# EasyEDA Pro project chislfashV1.0 普罗米修斯.epro, board ChisFlash-Onix-1.2
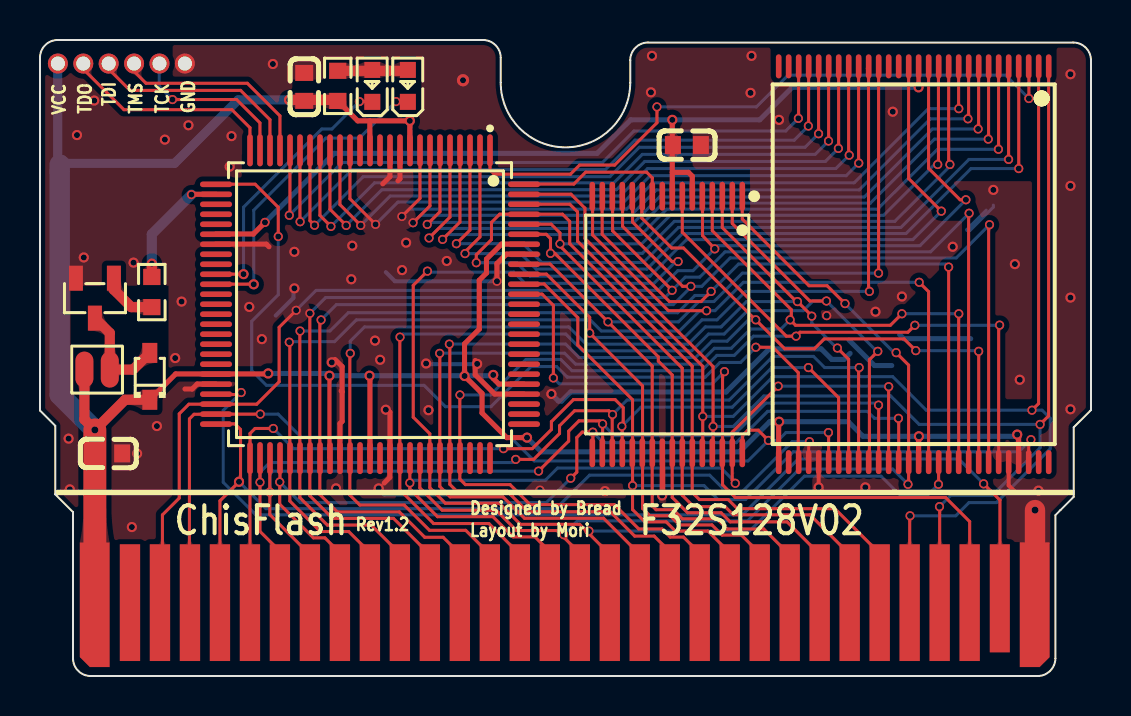
[diagram p4: board, top side]
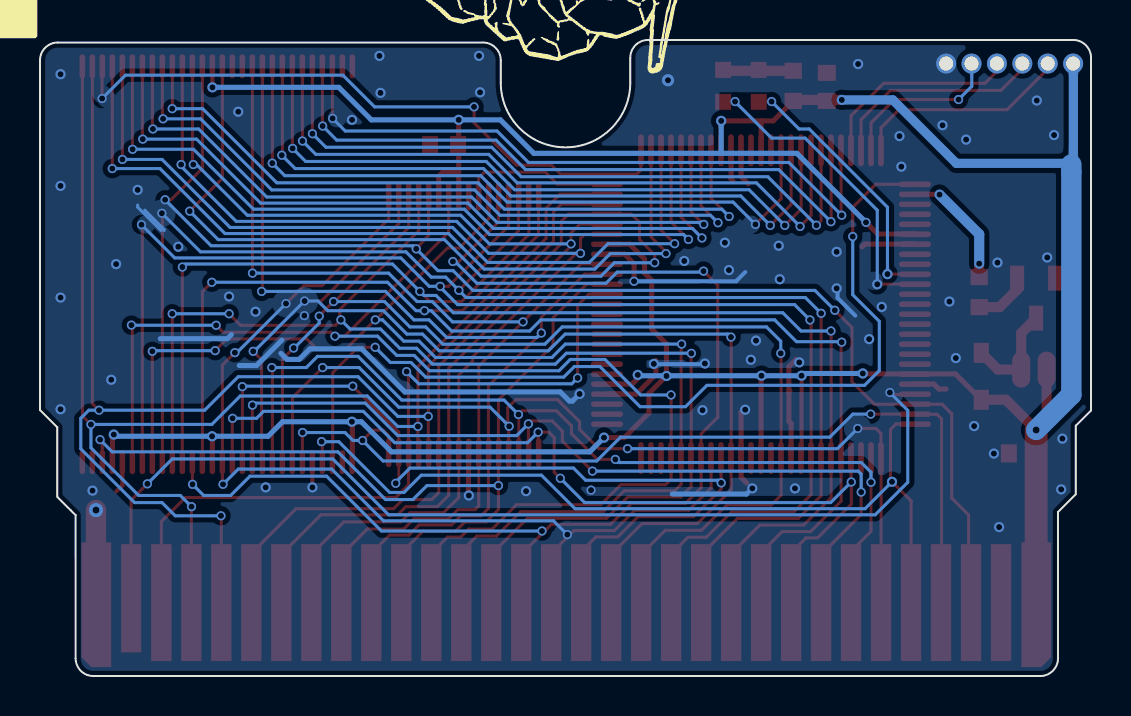
[diagram p5: board, bottom side, seen from below]

Outline 52.55 x 31.83 mm; copper layers: Top Layer, Bottom Layer. Coordinates in mm from the lower left corner of the outline.
Outline path: 0,30.94 0,13.28 0.76,12.52 0.76,9.09 1.65,8.2 1.65,0.89 arc(1.91,0.26) 2.54,0 49.88,0 arc(50.51,0.26) 50.77,0.89 50.77,8.05 51.69,8.97 51.69,12.45 52.55,13.31 52.55,30.81 arc(52.29,31.44) 51.66,31.7 30.4,31.7 arc(29.77,31.44) 29.51,30.81 29.51,29.69 arc(26.28,26.45) 23.04,29.69 23.04,30.94 arc(22.78,31.57) 22.15,31.83 0.89,31.83 arc(0.26,31.57) 0,30.94
Stack: Top Layer 0.035mm - / Dielectric1 1.51mm FR4 er 4.5 / Bottom Layer 0.035mm -

## Design rules (mm)
template: 自定义配置
spacing copperThickness1oz (default): track to track 0.152, other pairs 0.152 to 0.152
spacing copperThickness2oz: track to track 0.152, other pairs 0.152 to 0.152
track width copperThickness1oz (default): min 0.152, default 0.152, max 2.54
track width copperThickness2oz: min 0.152, default 0.254, max 2.54
differential pair differentialPair (default): width min 0.152, default 0.254, max 2.54; gap min 0.152, default 0.152
via viaSize (default): diameter min 0.406, default 0.457, max 10; hole min 0.305, default 0.305, max 6.299

## Placement (name value [footprint] x y rotation side)
C1  100nF  [C0603]  32.35 26.57 180 top
C2  100nF  [C0603]  13.21 29.48 270 top
C3  100nF  [C0603]  3.41 11.14 180 top
CART2  -  [GBA卡带金手指]  26.22 3.04 0 top
D1  1N4148WS  [SOD-323_L1.8-W1.3-LS2.5-RD]  5.49 15 90 top
LED1  NCD0603B1  [LED0603-RD]  16.62 29.53 90 top
LED2  NCD0603G1  [LED0603-RD]  18.4 29.53 90 top
MOT1  LCM1027A2445F  [VIBRATING-MOTOR-SMD_WELDING]  2.86 15.33 180 top
Q2  S9013 J3  [SOT-23-3_L2.9-W1.3-P1.90-LS2.4-BR]  2.75 18.91 90 top
R1  1kΩ  [R0603]  14.89 29.53 270 top
R3  10K  [R0603]  5.59 19.21 90 top
U2  S29GL256S10TFI010  [TSOP-56_L18.4-W14.0-P0.50-LS20.0-TL]  43.69 20.6 270 top
U4  FM28V100-TG  [STSOP-32_L8.0-W11.8-P0.50-LS13.4-TL]  31.37 17.59 270 top
U5  EPM240T100C5N  [TQFP-100_L14.0-W14.0-P0.50-LS16.0-BL]  16.5 18.6 180 top
XP1  JTAG  [HDR-TH_6P-P1.27-V-M-1]  4.07 30.65 0 top

## Footprints (pads in the part's own frame, mm; a bottom-side part is the same pattern mirrored in y, then rotated)
C0603
  rect 0.8x0.9 smd: 1(-0.7,0) 2(0.7,0)
GBA卡带金手指
  custom 1.491x6.239 smd: 1(-23.48,0.522)
  rect 1.016x5.842 smd: 2(-21.718,0.626) 3(-20.218,0.626) 4(-18.718,0.626) 5(-17.219,0.626) 6(-15.72,0.626) 7(-14.22,0.626) 8(-12.72,0.626) 9(-11.221,0.626) 10(-9.722,0.626) 11(-8.222,0.626) 12(-6.723,0.626) 13(-5.223,0.626) 14(-3.724,0.626) 15(-2.224,0.626) 16(-0.725,0.626) 17(0.775,0.626) 18(2.275,0.626) 19(3.774,0.626) 20(5.274,0.626) 21(6.773,0.626) 22(8.273,0.626) 23(9.772,0.626) 24(11.271,0.626) 25(12.771,0.626) 26(14.271,0.626) 27(15.77,0.626) 28(17.27,0.626) 29(18.769,0.626) 30(20.268,0.626)
  rect 1.001x5.407 smd: 31(21.776,0.844)
  custom 1.492x6.239 smd: 32(23.522,0.522)
HDR-TH_6P-P1.27-V-M-1
  round 1 hole 0.7: 1(-3.175,0) 2(-1.905,0) 3(-0.635,0) 4(0.635,0) 5(1.905,0) 6(3.175,0)
LED0603-RD
  rect 0.8x0.8 smd: 1(-0.799,0) 2(0.799,0)
R0603
  rect 0.806x0.864 smd: 1(-0.753,0) 2(0.753,0)
SOD-323_L1.8-W1.3-LS2.5-RD
  rect 1x0.75 smd: 1(-1.173,0) 2(1.173,0)
SOT-23-3_L2.9-W1.3-P1.90-LS2.4-BR
  rect 1.25x0.7 smd: 1(1,-0.95) 2(1,0.95) 3(-1,0)
STSOP-32_L8.0-W11.8-P0.50-LS13.4-TL
  oval 1.44x0.28 smd: 1(-6.42,3.75) 2(-6.42,3.25) 3(-6.42,2.75) 4(-6.42,2.25) 5(-6.42,1.75) 6(-6.42,1.25) 7(-6.42,0.75) 8(-6.42,0.25) 9(-6.42,-0.25) 10(-6.42,-0.75) 11(-6.42,-1.25) 12(-6.42,-1.75) 13(-6.42,-2.25) 14(-6.42,-2.75) 15(-6.42,-3.25) 16(-6.42,-3.75) 17(6.42,-3.75) 18(6.42,-3.25) 19(6.42,-2.75) 20(6.42,-2.25) 21(6.42,-1.75) 22(6.42,-1.25) 23(6.42,-0.75) 24(6.42,-0.25) 25(6.42,0.25) 26(6.42,0.75) 27(6.42,1.25) 28(6.42,1.75) 29(6.42,2.25) 30(6.42,2.75) 31(6.42,3.25) 32(6.42,3.75)
TQFP-100_L14.0-W14.0-P0.50-LS16.0-BL
  oval 0.28x1.6 smd: 1(-6,-7.7) 2(-5.5,-7.7) 3(-5,-7.7) 4(-4.5,-7.7) 5(-4,-7.7) 6(-3.5,-7.7) 7(-3,-7.7) 8(-2.5,-7.7) 9(-2,-7.7) 10(-1.5,-7.7) 11(-1,-7.7) 12(-0.5,-7.7) 13(0,-7.7) 14(0.5,-7.7) 15(1,-7.7) 16(1.5,-7.7) 17(2,-7.7) 18(2.5,-7.7) 19(3,-7.7) 20(3.5,-7.7) 21(4,-7.7) 22(4.5,-7.7) 23(5,-7.7) 24(5.5,-7.7) 25(6,-7.7) 51(6,7.7) 52(5.5,7.7) 53(5,7.7) 54(4.5,7.7) 55(4,7.7) 56(3.5,7.7) 57(3,7.7) 58(2.5,7.7) 59(2,7.7) 60(1.5,7.7) 61(1,7.7) 62(0.5,7.7) 63(0,7.7) 64(-0.5,7.7) 65(-1,7.7) 66(-1.5,7.7) 67(-2,7.7) 68(-2.5,7.7) 69(-3,7.7) 70(-3.5,7.7) 71(-4,7.7) 72(-4.5,7.7) 73(-5,7.7) 74(-5.5,7.7) 75(-6,7.7)
  oval 1.6x0.28 smd: 26(7.7,-6) 27(7.7,-5.5) 28(7.7,-5) 29(7.7,-4.5) 30(7.7,-4) 31(7.7,-3.5) 32(7.7,-3) 33(7.7,-2.5) 34(7.7,-2) 35(7.7,-1.5) 36(7.7,-1) 37(7.7,-0.5) 38(7.7,0) 39(7.7,0.5) 40(7.7,1) 41(7.7,1.5) 42(7.7,2) 43(7.7,2.5) 44(7.7,3) 45(7.7,3.5) 46(7.7,4) 47(7.7,4.5) 48(7.7,5) 49(7.7,5.5) 50(7.7,6) 76(-7.7,6) 77(-7.7,5.5) 78(-7.7,5) 79(-7.7,4.5) 80(-7.7,4) 81(-7.7,3.5) 82(-7.7,3) 83(-7.7,2.5) 84(-7.7,2) 85(-7.7,1.5) 86(-7.7,1) 87(-7.7,0.5) 88(-7.7,0) 89(-7.7,-0.5) 90(-7.7,-1) 91(-7.7,-1.5) 92(-7.7,-2) 93(-7.7,-2.5) 94(-7.7,-3) 95(-7.7,-3.5) 96(-7.7,-4) 97(-7.7,-4.5) 98(-7.7,-5) 99(-7.7,-5.5) 100(-7.7,-6)
TSOP-56_L18.4-W14.0-P0.50-LS20.0-TL
  oval 1.199x0.28 smd: 1(-9.901,6.752) 2(-9.901,6.251) 3(-9.901,5.75) 4(-9.901,5.25) 5(-9.901,4.75) 6(-9.901,4.25) 7(-9.901,3.749) 8(-9.901,3.251) 9(-9.901,2.751) 10(-9.901,2.251) 11(-9.901,1.75) 12(-9.901,1.25) 13(-9.901,0.75) 14(-9.901,0.249) 15(-9.901,-0.249) 16(-9.901,-0.75) 17(-9.901,-1.25) 18(-9.901,-1.75) 19(-9.901,-2.251) 20(-9.901,-2.751) 21(-9.901,-3.248) 22(-9.901,-3.749) 23(-9.901,-4.25) 24(-9.901,-4.75) 25(-9.901,-5.25) 26(-9.901,-5.75) 27(-9.901,-6.251) 28(-9.901,-6.749) 29(9.901,-6.749) 30(9.901,-6.251) 31(9.901,-5.75) 32(9.901,-5.25) 33(9.901,-4.75) 34(9.901,-4.25) 35(9.901,-3.749) 36(9.901,-3.248) 37(9.901,-2.751) 38(9.901,-2.251) 39(9.901,-1.75) 40(9.901,-1.25) 41(9.901,-0.75) 42(9.901,-0.249) 43(9.901,0.249) 44(9.901,0.75) 45(9.901,1.25) 46(9.901,1.75) 47(9.901,2.251) 48(9.901,2.751) 49(9.901,3.251) 50(9.901,3.749) 51(9.901,4.25) 52(9.901,4.75) 53(9.901,5.25) 54(9.901,5.75) 55(9.901,6.251) 56(9.901,6.752)
VIBRATING-MOTOR-SMD_WELDING
  oval 0.9x1.8 smd: 1(-0.635,0) 2(0.635,0)

## Nets
As in the schematic.

Pads without a net: CART2 2; U2 16 17 27 28 30 55 56; U4 9; U5 12 14 37 38 39 40 41 42 43 44 62 64 73 74 75 76 77 78 81 82 83 84 85 86 87 88

## Via types
v1: diameter 0.457, hole 0.305, Top Layer to Bottom Layer, 129 vias
v2: diameter 0.508, hole 0.305, Top Layer to Bottom Layer, 72 vias
v3: diameter 0.711, hole 0.355, Top Layer to Bottom Layer, 2 vias
v4: diameter 0.61, hole 0.305, Top Layer to Bottom Layer, 1 via

## Routing (per net, layer and track width the routed paths; a pad name or vN(x,y) marks a point on that pad's centre or on a via; arc(x,y) is an arc through that point)
GND: length 72.6
  Top Layer w0.203: 48.44,10.71 48.44,9.54 48.74,9.24 ; v2(38.93,9.44) 38.94,9.44 38.94,10.71
  Top Layer w0.254: 14.99,10.92 15,12.63 15.11,12.74 15.11,14.22 ; 14.75,15.84 15.11,15.49 15.11,14.22 ; 21.76,15.79 21.76,15.08 22.73,14.11 24.2,14.11 ; 24.2,21.11 23.32,21.11 22.85,20.64 v1(22.85,19.75) ; 17.5,26.31 17.5,24.99 17.14,24.63 ; 15.11,14.22 15.06,14.27 ; 31.13,10.88 31.13,9.05 v2(31.11,9.03) ; 18,26.31 18,24.88 17.9,24.78 ; 17.21,9.66 17.49,9.94 17.49,10.73 ; 8.8,21.61 11.32,21.61 11.45,21.48 ; 8.8,14.61 7.86,14.61 7.61,14.36 7.25,14.36 ; 17.39,13.3 17.5,13.2 17.5,10.91
  Top Layer w1.016: 49.75,2.94 v3(49.75,8.3)
  Bottom Layer w0.152: 47.31,23.31 46.35,22.34 46.35,22.29 ; 47.67,23.56 47.67,23.46 46.5,22.29
  Bottom Layer w0.203: 11.79,18.03 12.67,18.92 12.67,19.48 ; v1(22.85,19.75) 17.75,19.75 17.29,20.21 ; 19.32,15.56 19.37,15.6 21.9,15.6
  Bottom Layer w0.254: 17.18,9.16 17.23,9.11 20.94,9.11 ; 40.46,16.81 41.73,15.54 42.59,15.54 ; 40.51,16.15 40.2,15.84 39.59,15.84 39.06,16.37 36.47,16.37 34.31,14.22 26.54,14.22 26.08,13.76 25.93,13.76 v2(25.57,14.11) ; 46.54,16.88 43.19,16.88 42.98,17.08
  vias: v1(25,9.3) v1(39.34,18.03) v2(1.43,11.88) v2(1.49,9.34) v2(1.85,27.07) v2(2.19,20.94) v2(2.71,28.8) v2(4.59,7.45) v2(4.68,20.69) v2(4.86,11.13) v2(5.85,12.51) v2(6.24,26.84) v2(6.76,15.91) v2(7.08,18.74) v2(7.42,27.56) v2(9.48,25.49) v2(9.58,27.02) v2(10.46,18.47) v2(11.09,16.86) v2(11.65,30.62) v2(12.72,21.23) v2(12.72,19.4) v2(14.59,15.69) v2(14.8,9.39) v2(15.56,19.85) v2(15.62,21.53) v2(16.75,16.78) v2(16.94,9.39) v2(17.01,15.82) v2(17.29,13.33) v2(18.1,20.31) v2(18.31,21.68) v2(19.31,15.64) v2(19.43,13.3) v2(20.34,20.77) v2(21.86,15.62) v2(28.25,9.25) v2(30.55,29.21) v2(30.6,31.03) v2(35.53,29.18) v2(35.58,31.03) v2(36.95,27.83) v2(41.27,9.44) v2(41.78,18.23) v2(42.64,28.24) v2(43.1,18.99) v2(45.64,21.48) v2(47.67,24.32) v2(48.75,20.61) v2(48.99,14.82) v2(49.93,9.28) v2(51.53,30.11) v2(51.53,24.52) v2(51.53,18.94) v2(51.53,13.35) v4(21.15,29.81)
VCC: length 175.2
  Top Layer w0.203: v2(43.93,29.46) 43.93,30.51 ; v2(14.47,15.03) 14.47,10.93 14.5,10.91
  Top Layer w0.254: 16.49,27.78 v2(18.49,27.78) 18.49,26.32 ; 16.49,27.78 16.49,26.32 ; 16.49,27.78 15.89,27.78 R1.2 ; U4.6 32.62,25.01 32.43,25.2 31.62,25.2 ; D1.1 6.78,15.12 11.39,15.12 v2(11.41,15.14) ; 31.62,25.2 U4.8 ; 31.62,25.2 v2(31.62,27.83) ; 8.79,22.12 10.67,22.12 v1(11.25,22.7) ; 16.5,10.91 16.5,15.01 v2(16.48,15.03) ; v2(24.35,11.93) 23.34,11.93 22.1,13.16 22.1,14.14 v2(21.23,15.01) 21.23,16.62 21.97,17.36 21.97,19.8 22.32,20.16 22.32,20.86 23.07,21.61 24.2,21.61 ; v2(48.86,12.08) 48.93,12.01 48.93,10.54 ; 43.93,10.54 43.93,11.98 v2(43.95,12) ; v2(22.66,15.07) 22.66,14.89 22.94,14.61 24.2,14.61 ; v2(36.96,12.72) 36.93,12.7 36.93,10.33
  Top Layer w0.508: R1.2 14.84,28.83 v2(12.46,28.83) ; D1.1 4.25,13.82 v3(2.74,12.31) 2.22,12.83 MOT1.2
  Top Layer w1.143: 2.74,4.63 v3(2.74,12.31)
  Bottom Layer w0.254: v2(48.86,12.08) 48.78,12 v2(43.95,12) 41.15,12 40.42,12.72 v2(36.96,12.72) 36.48,12.72 34.98,11.22 25.06,11.22 v2(24.35,11.93) ; 18.48,26.15 27.86,26.15 29.53,27.83 v2(31.62,27.83) 35.99,27.83 37.61,29.46 v2(43.93,29.46) ; 18.48,26.15 18.49,26.16 v2(18.49,27.78) ; 18.48,26.15 14.71,26.15 v1(11.25,22.7) ; v2(22.66,15.07) 22.62,15.03 v2(16.48,15.03) v2(14.47,15.03) 14.36,15.14 v2(11.41,15.14)
  Bottom Layer w0.457: 0.98,25.24 0.88,25.34 0.88,30.6 ; v2(12.46,28.83) 9.91,28.83 6.73,25.65 1.04,25.65 0.98,25.59
  Bottom Layer w1.016: 2.74,12.31 0.98,14.07 0.98,25.59
A16: length 45
  Top Layer w0.152: 24.19,19.62 25.21,19.62 26.89,17.93 26.89,16.56 29.63,13.82 v1(29.63,9.53) 29.63,8.33 30.25,7.71 31.31,7.71 31.77,7.26 33.4,7.26 34.49,6.16 CART2.22 ; 49.44,10.71 49.44,11.71 v1(49.55,11.83)
  Bottom Layer w0.152: v1(49.55,11.83) 48.94,11.22 37.66,11.22 35.27,8.83 33.9,8.83 33.21,9.53 v1(29.63,9.53)
A17: length 50.3
  Top Layer w0.152: v1(41.47,19.24) 41.43,19.29 41.43,30.34 41.37,30.4 ; CART2.23 35.99,6.13 35.07,7.05 34.11,7.05 33.6,7.56 31.97,7.56 31.52,8.02 30.5,8.02 30.13,8.39 30.13,14.52 v1(27.49,17.16) 27.49,17.95 25.32,20.11 24.2,20.11
  Bottom Layer w0.152: v1(27.49,17.16) 27.71,16.94 32.22,16.94 33.1,17.82 33.85,17.82 35.27,19.24 v1(41.47,19.24)
A18: length 50.5
  Top Layer w0.152: 37.49,3.67 37.49,6.06 36.19,7.36 34.36,7.36 33.85,7.87 32.12,7.87 31.67,8.32 30.8,8.32 30.61,8.51 30.61,15.51 v1(28.4,17.72) 25.51,20.62 24.21,20.62 24.2,20.61 ; 41.93,30.34 41.93,20.16 v1(41.93,20.16)
  Bottom Layer w0.152: v1(41.93,20.16) 35.12,20.16 33.7,18.74 32.94,18.74 31.92,17.72 v1(28.4,17.72)
A19: length 54.8
  Top Layer w0.152: 45.44,30.51 45.44,25.66 v1(45.5,25.59) ; CART2.25 38.99,6.08 37.36,7.71 34.51,7.71 34.06,8.17 32.38,8.17 31.61,8.94 31.61,15.06 30.92,15.76 30.92,15.97 25.74,21.15 v1(25.53,21.15) 25.53,21.89 25.31,22.1 U5.95
  Bottom Layer w0.152: v1(45.5,25.59) 45.5,25.51 42.74,22.75 31.72,22.75 30.12,21.15 v1(25.53,21.15)
A20: length 54.6
  Top Layer w0.152: CART2.26 40.49,6.08 38.5,8.07 34.66,8.07 34.26,8.47 32.68,8.47 32.11,9.05 32.11,15.4 26,21.52 v1(26,21.62) 26,22.17 25.56,22.61 24.2,22.61 ; 44.93,30.03 44.93,25.63 v1(44.89,25.59)
  Bottom Layer w0.152: v1(26,21.62) 30.08,21.62 31.52,23.05 42.18,23.05 44.72,25.59 v1(44.89,25.59)
A21: length 68.4
  Top Layer w0.152: v1(21.82,20.68) 21.82,21.08 22.57,21.84 22.57,22.7 22.99,23.11 26.13,23.11 26.49,22.75 26.49,21.63 32.61,15.5 32.61,9.19 32.97,8.83 34.41,8.83 34.87,8.37 39.75,8.37 41.99,6.13 CART2.27 ; 43.43,30.34 43.43,24.89 v1(45.07,23.26)
  Bottom Layer w0.152: v1(21.82,20.68) 23.83,20.68 24.5,20.01 30.5,20.01 32.33,21.84 43.64,21.84 v1(45.07,23.26)
A22: length 68
  Top Layer w0.152: 24.2,23.61 26.49,23.61 26.88,23.22 26.88,21.76 33.14,15.5 33.14,11.25 33.09,11.2 ; CART2.28 43.49,8 v1(43.5,8.02) ; 49.93,30.34 49.93,13.63 v1(49.6,13.3)
  Bottom Layer w0.152: v1(43.5,8.02) 45.79,8.02 46.45,8.68 47.82,8.68 50.51,11.37 50.51,12.89 50.11,13.3 v1(49.6,13.3) 44.32,13.3 42.64,14.98 36.65,14.98 34.66,12.99 v1(33.14,12.99)
A23: length 65.6
  Top Layer w0.152: CART2.29 44.99,8.47 v1(44.98,8.47) ; 33.6,11.51 33.66,11.57 v1(33.66,12.49) 33.66,15.49 27.25,21.89 27.25,23.41 26.55,24.11 24.2,24.11 ; v1(50.01,12.59) 50.43,13.02 50.43,30.34
  Bottom Layer w0.152: v1(33.66,12.49) 34.66,12.49 36.19,14.01 42.54,14.01 43.96,12.59 v1(50.01,12.59) 50.01,11.42 47.62,9.03 45.54,9.03 v1(44.98,8.47)
AD0: length 47.7
  Top Layer w0.152: v1(38.42,15.43) 39.93,13.92 39.93,10.54 ; v1(11.66,12.39) 10.75,12.39 10.5,12.14 U5.51 ; 10.5,10.71 10.5,3.1 ; 29.11,11.22 29.11,12.48 v1(29.09,12.5) 29.16,12.57 29.16,13.42 28.76,13.83 26.67,13.83 25.57,12.73 25.57,12.34 24.61,11.38 v1(23.18,11.38)
  Bottom Layer w0.152: v1(38.42,15.43) 36.6,15.43 34.61,13.45 30.05,13.45 v1(29.09,12.5) ; v1(23.18,11.38) 12.67,11.38 v1(11.66,12.39)
AD1: length 47.6
  Top Layer w0.152: 28.61,11.22 28.61,13.07 v1(28.63,13.09) 28.44,13.27 26.73,13.27 25.98,12.52 25.98,12.13 24.69,10.84 v1(23.79,10.84) ; 11.01,10.6 11,10.59 v1(11,9.7) 11,7.24 12,6.24 CART2.7 ; 40.93,10.54 40.93,15.41 v1(40.96,15.43)
  Bottom Layer w0.152: v1(40.96,15.43) 39.24,15.43 38.68,15.99 36.65,15.99 34.46,13.81 29.35,13.81 v1(28.63,13.09) ; v1(23.79,10.84) 23.63,10.68 11.49,10.68 11,10.2 v1(11,9.7)
AD2: length 46.1
  Top Layer w0.152: 11.49,10.9 v1(11.49,9.2) 11.49,8.08 13.5,6.07 13.5,3.67 ; v1(24.93,10.25) 26.43,11.76 26.43,12.25 26.95,12.77 27.98,12.77 v1(28.13,12.62) 28.13,11.24 28.11,11.22 ; 41.94,10.71 41.94,13.55 v1(41.93,13.55)
  Bottom Layer w0.152: v1(24.93,10.25) 11.64,10.25 11.49,10.1 v1(11.49,9.2) ; v1(41.93,13.55) 41.83,13.66 36.29,13.66 34.66,12.03 28.72,12.03 v1(28.13,12.62)
AD3: length 46.9
  Top Layer w0.152: 27.6,11.17 27.64,11.21 v1(27.64,12.2) 27.11,12.2 26.84,11.93 26.84,10.2 v1(26.54,9.9) ; CART2.9 15,6.16 14.24,6.91 13.67,6.91 11.99,8.6 v1(11.99,9.71) 12,9.72 12,10.91 ; v1(42.93,12.89) 42.94,12.88 42.94,10.71
  Bottom Layer w0.152: v1(42.93,12.89) 41.73,12.89 41.38,13.24 36.39,13.24 34.82,11.68 28.17,11.68 v1(27.64,12.2) ; v1(11.99,9.71) 13.02,8.68 25.32,8.68 v1(26.54,9.9)
AD4: length 64.6
  Top Layer w0.152: v1(12.47,16.7) 12.49,16.68 12.49,8.76 14.02,7.23 15.44,7.23 16.32,6.34 ; v1(43.96,19.7) 44.43,19.23 44.43,10.54 ; v1(33.33,18.28) 31.42,18.28 27.63,22.07 27.63,23.99 U4.16
  Bottom Layer w0.152: v1(12.47,16.7) 12.49,16.73 14.73,16.73 15.82,17.82 27.51,17.82 28.07,17.26 31.97,17.26 32.99,18.28 v1(33.33,18.28) 33.75,18.28 35.17,19.7 v1(43.96,19.7)
AD5: length 67
  Top Layer w0.152: v1(45.43,20.46) 45.43,10.54 45.43,10.54 ; v1(33.56,19.24) 33.05,18.74 31.47,18.74 28.11,22.1 28.11,24.07 ; 17.79,6.32 16.56,7.55 14.37,7.55 12.99,8.93 12.99,17.26
  Bottom Layer w0.152: v1(45.43,20.46) 45.28,20.62 34.93,20.62 v1(33.56,19.24) 33.36,19.04 32.75,19.04 31.88,18.18 15.41,18.18 14.5,17.26 v1(13,17.26)
AD6: length 69.7
  Top Layer w0.152: 46.43,10.54 46.43,23.13 v1(46.46,23.16) ; v1(13.49,18.15) 13.49,18.14 13.49,9.02 14.63,7.89 17.68,7.89 19.26,6.3 19.3,6.3 ; v1(31.61,19.3) 28.63,22.28 28.63,23.99 U4.14
  Bottom Layer w0.152: v1(13.49,18.15) 14.29,18.94 31.25,18.94 v1(31.61,19.3) 32.27,19.96 32.99,19.96 34.26,21.23 44.53,21.23 v1(46.46,23.16)
AD7: length 70.9
  Top Layer w0.152: v1(47.48,22.58) 47.43,22.54 47.43,10.71 ; v1(14.05,17.82) 13.99,17.76 13.99,9.08 14.86,8.21 17.97,8.21 19.24,6.94 20.16,6.94 21.26,5.84 21.26,5.78 ; U4.13 29.13,23.99 29.13,22.5 32.13,19.5 v1(32.54,19.5)
  Bottom Layer w0.152: v1(47.48,22.58) 45.82,20.92 34.51,20.92 33.09,19.5 v1(32.54,19.5) 32.54,19.46 31.67,18.58 14.82,18.58 v1(14.05,17.82)
AD8: length 58.4
  Top Layer w0.152: 40.43,10.54 40.43,15.85 v1(39.87,16.41) ; CART2.14 22.49,6.08 21.29,7.29 19.48,7.29 18.21,8.56 15.99,8.56 15.49,9.05 15.49,16.12 v1(15.51,16.15) ; U4.3 34.12,22.44 37.82,18.74 v1(37.88,18.74) 38.59,18.02 v1(38.59,18.01)
  Bottom Layer w0.152: v1(15.51,16.15) 15.51,16.76 16.22,17.47 26.44,17.47 27.31,16.6 32.4,16.6 33.27,17.47 34.06,17.47 35.33,18.74 v1(37.88,18.74) ; v1(39.87,16.41) 39.84,16.41 38.59,17.66 v1(38.59,18.01)
AD9: length 57.2
  Top Layer w0.152: 41.44,10.71 41.47,10.75 41.47,15.83 v1(41.89,16.25) ; U4.2 34.62,22.64 38.49,18.77 v1(39.32,18.77) ; v1(18,16.96) 17.99,16.95 17.99,9.32 19.68,7.63 22.45,7.63 23.99,6.08 CART2.15
  Bottom Layer w0.152: v1(18,16.96) 18.16,17.11 26.29,17.11 27.13,16.27 32.59,16.27 33.43,17.11 34.21,17.11 35.38,18.28 38.17,18.28 38.65,18.77 v1(39.32,18.77) 41.84,16.25 v1(41.89,16.25)
AD10: length 44.6
  Top Layer w0.152: 42.43,10.54 42.43,14.47 v1(42.44,14.48) ; v1(36.91,14.5) 34.61,12.2 34.61,11.22 ; v1(34.77,9.64) 34.61,9.8 34.61,11.17 ; CART2.16 25.49,6.22 24.75,6.96 23.66,6.96 22.65,7.97 19.88,7.97 18.49,9.36 v1(18.49,9.66) 18.49,10.91 U5.67
  Bottom Layer w0.152: v1(36.91,14.5) 42.41,14.5 v1(42.44,14.48) ; v1(34.77,9.64) 34.77,9.69 34.06,10.41 25.88,10.41 25.27,9.8 18.62,9.8 v1(18.49,9.66)
AD11: length 50.7
  Top Layer w0.152: CART2.17 26.99,3.67 26.99,6.24 26.89,6.24 25.85,7.28 23.83,7.28 22.81,8.3 20.11,8.3 18.99,9.42 18.99,10.92 ; U4.1 35.12,22.86 38.45,19.53 39.36,19.53 v1(40.25,18.63) ; v1(42.81,16.18) 43.43,15.56 43.43,9.62 v1(43.4,9.59)
  Bottom Layer w0.152: v1(43.4,9.59) 42.64,10.35 37.97,10.35 35.38,7.76 26.87,7.76 v1(26.19,7.07) ; v1(42.81,16.18) 42.71,16.18 v1(40.25,18.63)
AD12: length 62.2
  Top Layer w0.152: v1(44.93,9.59) 44.93,9.6 44.93,10.54 ; U4.12 29.63,23.99 29.63,22.71 31.6,20.74 v1(31.91,20.74) ; CART2.18 28.47,3.69 28.47,6.24 28.34,6.24 26.99,7.59 24.02,7.59 22.97,8.64 20.27,8.64 19.49,9.42 19.49,12.12 18.66,12.95 18.66,19.55 v1(19.37,20.26)
  Bottom Layer w0.152: v1(44.93,9.59) 44.37,9.03 43.02,9.03 42.05,10 38.22,10 35.48,7.26 v1(27.45,7.26) ; v1(19.37,20.26) 19.43,20.21 23.69,20.21 24.25,19.65 30.7,19.65 31.79,20.74 v1(31.91,20.74)
AD13: length 63.3
  Top Layer w0.152: v1(43.1,18.13) 42.52,17.55 37.78,17.55 v1(37.51,17.82) 37.57,17.88 37.57,18.33 33.62,22.28 U4.4 ; v1(19.98,16.15) 19.99,16.14 19.99,9.48 20.51,8.97 23.15,8.97 24.22,7.89 28.18,7.89 29.84,6.24 29.99,6.24 CART2.19 ; 45.94,10.71 45.94,18.12 v1(45.94,18.13)
  Bottom Layer w0.152: v1(19.98,16.15) 19.99,16.15 26.23,16.15 26.78,15.61 32.93,15.61 33.72,16.4 34.56,16.4 35.53,17.36 37.05,17.36 v1(37.51,17.82) ; v1(43.1,18.13) v1(45.94,18.13)
AD14: length 62
  Top Layer w0.152: 20.49,16.58 20.49,9.59 20.81,9.27 23.33,9.27 24.38,8.22 28.52,8.22 29.74,7 30.71,7 31.45,6.26 31.5,6.26 ; 46.94,10.71 46.94,16.25 ; 30.09,23.62 30.09,22.91 31.59,21.42 32.18,21.42 35.77,17.82 v1(35.79,17.82) 37.24,16.38 38.72,16.38 39.21,16.87 43.21,16.87 v1(43.79,16.28)
  Bottom Layer w0.152: v1(46.94,16.25) 46.9,16.28 v1(43.79,16.28) ; v1(35.79,17.82) 35.43,17.82 34.36,16.76 33.6,16.76 32.78,15.94 26.96,15.94 26.29,16.61 v1(20.47,16.61)
AD15: length 65.6
  Top Layer w0.152: v1(47.98,17.56) 47.94,17.51 47.94,10.71 ; v1(21,14.06) 20.99,14.05 20.99,9.85 21.27,9.58 23.51,9.58 24.51,8.58 28.72,8.58 29.94,7.36 31.11,7.36 31.52,6.95 32.18,6.95 32.99,6.14 32.99,3.67 ; v1(43.75,17.55) 43.4,17.2 38,17.2 v1(37.81,17.01) 37.32,17.01 32.12,22.21 U4.7
  Bottom Layer w0.152: v1(47.98,17.56) 47.98,17.55 v1(43.75,17.55) ; v1(37.81,17.01) 35.68,17.01 34.72,16.04 33.85,16.04 33.08,15.28 26.6,15.28 26.04,15.84 24.3,15.84 22.52,14.06 v1(21,14.06)
BK: length 7.7
  Top Layer w0.152: U4.10 30.62,24.93 30.33,25.21 27.28,25.21 26.69,24.62 24.19,24.62
FA0: length 47.2
  Top Layer w0.152: v1(11.91,21.99) 11.91,23.45 10.76,24.61 8.8,24.61 ; v1(35.79,16.45) 36.65,16.45 37.92,15.18 37.92,10.53 37.92,10.53
  Bottom Layer w0.152: v1(11.91,21.99) 11.91,19.08 10.59,17.75 10.59,15.28 11.32,14.54 19.21,14.54 20.27,13.48 22.55,13.48 24.56,15.49 25.83,15.49 26.36,14.96 33.27,14.96 34,15.69 35.03,15.69 v1(35.79,16.45)
FA1: length 33.2
  Top Layer w0.152: v1(12.47,23.05) 12.5,23.09 12.5,26.31 ; 37.93,30.34 37.93,27.91 v1(37.92,27.9)
  Bottom Layer w0.152: v1(37.92,27.9) 37.29,27.27 29.7,27.27 28.13,25.7 15.11,25.7 v1(12.47,23.05)
FA2: length 33.8
  Top Layer w0.152: 38.43,30.34 38.43,27.53 v1(38.42,27.52) ; v1(13,22.73) 13,22.74 13,26.31
  Bottom Layer w0.152: v1(38.42,27.52) 37.71,26.81 29.75,26.81 28.28,25.34 15.61,25.34 v1(13,22.73)
FA3: length 34.2
  Top Layer w0.152: 13.5,26.31 13.5,22.78 v1(13.73,22.55) ; v1(38.93,27.13) 38.93,30.34
  Bottom Layer w0.152: v1(38.93,27.13) 38.25,26.46 29.97,26.46 28.49,24.98 16.16,24.98 v1(13.73,22.55)
FA4: length 34.3
  Top Layer w0.152: 14,26.31 14,23.05 v1(14.55,22.5) ; 39.43,30.34 39.43,26.77 v1(39.43,26.77)
  Bottom Layer w0.152: v1(14.55,22.5) 16.73,24.68 28.69,24.68 30.12,26.1 38.76,26.1 v1(39.43,26.77)
FA5: length 34.3
  Top Layer w0.152: v1(15.31,22.55) 14.5,23.36 14.5,26.31 ; v1(39.92,26.4) 39.93,26.41 39.93,30.34
  Bottom Layer w0.152: v1(15.31,22.55) 17.1,24.33 28.83,24.33 30.24,25.75 39.27,25.75 v1(39.92,26.4)
FA6: length 34.4
  Top Layer w0.152: 40.43,30.34 40.43,26.09 v1(40.46,26.06) ; v1(16.04,22.55) 15,23.59 15,26.31
  Bottom Layer w0.152: v1(16.04,22.55) 17.51,24.02 29.01,24.02 30.38,25.39 39.79,25.39 v1(40.46,26.06)
FA7: length 34.4
  Top Layer w0.152: v1(40.94,25.66) 40.93,25.67 40.93,30.34 ; v1(16.78,22.6) 15.5,23.88 15.5,26.31
  Bottom Layer w0.152: v1(40.94,25.66) 40.31,25.04 30.52,25.04 29.19,23.71 17.9,23.71 v1(16.78,22.6)
FA8: length 35.7
  Top Layer w0.152: v1(18.09,22.99) 19,23.9 19,26.31 ; v1(45.94,28.39) 45.93,28.4 45.93,30.34
  Bottom Layer w0.152: v1(45.94,28.39) 44.42,28.39 40.71,24.68 30.65,24.68 29.33,23.36 18.46,23.36 v1(18.09,22.99)
FA9: length 36.4
  Top Layer w0.152: v1(18.65,22.68) 19.5,23.53 19.5,26.31 ; 46.43,30.34 46.43,27.91 v1(46.4,27.88)
  Bottom Layer w0.152: v1(18.65,22.68) 19.03,23.05 29.55,23.05 30.82,24.32 40.96,24.32 44.52,27.88 v1(46.4,27.88)
FA10: length 36.5
  Top Layer w0.152: v1(46.91,27.37) 46.93,27.4 46.93,30.34 ; v1(19.36,22.6) 20,23.23 20,26.31
  Bottom Layer w0.152: v1(46.91,27.37) 44.62,27.37 41.22,23.97 30.97,23.97 29.7,22.7 19.47,22.7 v1(19.36,22.6)
FA11: length 38.3
  Top Layer w0.152: 47.43,30.34 47.43,26.88 v1(47.42,26.86) ; v1(19.45,21.92) 20.5,22.96 20.5,26.31
  Bottom Layer w0.152: v1(47.42,26.86) 44.72,26.86 41.52,23.66 31.15,23.66 29.88,22.39 19.93,22.39 v1(19.45,21.92)
FA12: length 38.5
  Top Layer w0.152: 47.93,30.34 47.93,26.36 v1(47.92,26.36) ; v1(20.13,21.85) 21,22.71 21,26.31
  Bottom Layer w0.152: v1(20.13,21.85) 20.37,22.09 30.07,22.09 31.34,23.36 41.88,23.36 44.88,26.36 v1(47.92,26.36)
FA13: length 39.6
  Top Layer w0.152: v1(20.82,21.63) 21.5,22.31 21.5,26.31 ; v1(48.43,25.85) 48.43,30.34
  Bottom Layer w0.152: v1(20.82,21.63) 24.15,21.63 25.09,20.69 30.17,20.69 31.92,22.44 43.05,22.44 46.45,25.85 v1(48.43,25.85)
FA14: length 40.5
  Top Layer w0.152: 48.93,30.34 48.94,30.33 v1(48.94,25.39) ; v1(21.25,21.14) 21.25,21.22 22,21.97 22,26.31
  Bottom Layer w0.152: v1(48.94,25.39) 46.55,25.39 43.3,22.14 32.12,22.14 30.35,20.36 24.81,20.36 24.03,21.14 v1(21.25,21.14)
FA15: length 32.5
  Top Layer w0.152: U5.1 22.5,25.32 22.71,25.11 26.52,25.11 26.98,25.57 28.73,25.57 30.85,27.68 v1(30.85,28.48) ; 49.43,30.34 49.45,30.32 v1(49.45,28.9)
  Bottom Layer w0.152: v1(49.45,28.9) 48.28,30.06 37.41,30.06 35.82,28.48 v1(30.85,28.48)
GPIO3: length 6.2
  Top Layer w0.254: v1(7.57,24.09) 7.59,24.1 U5.27
  Top Layer w0.508: v1(5.59,20.63) R3.2
  Bottom Layer w0.508: v1(7.57,24.09) 5.59,22.11 v1(5.59,20.63)
LED1: length 13.4
  Top Layer w0.152: v2(10.18,20.11) 8.8,20.11 ; v1(15.97,28.74) 16.6,28.74 LED1.1
  Bottom Layer w0.152: v2(10.18,20.11) 10.18,23.46 14.09,27.37 14.6,27.37 v1(15.97,28.74)
LED2: length 15.6
  Top Layer w0.152: 8.8,19.61 10.68,19.61 v2(10.69,19.6)
  Top Layer w0.203: v1(17.8,28.74) 18.38,28.74 LED2.1
  Bottom Layer w0.152: v1(17.8,28.74) 15.97,26.92 14.29,26.92 10.69,23.31 v2(10.69,19.6)
REQ: length 53.1
  Top Layer w0.152: v1(10.06,14.19) 9.96,14.08 9.13,14.08 ; 48,3.1 48,8.8 v1(47.18,9.62)
  Bottom Layer w0.152: v1(47.18,9.62) 45.94,10.86 37.92,10.86 35.12,8.07 10.79,8.07 9.16,9.69 9.16,13.29 v1(10.06,14.19)
TCK: length 8.3
  Top Layer w0.152: 11,26.31 11,27.68 9.83,28.85 v1(6.62,28.85)
  Bottom Layer w0.152: 5.96,30.6 5.96,29.51 v1(6.62,28.85)
TDI: length 10.9
  Top Layer w0.152: 3.42,30.6 3.42,30.38 4.5,29.3 10.03,29.3 11.5,27.84 11.5,26.31
TDO: length 10.9
  Top Layer w0.152: 2.15,30.6 2.15,30.38 4.2,28.34 9.6,28.34 10.5,27.44 10.5,26.31
TMS: length 10.3
  Top Layer w0.152: 4.69,30.6 4.69,30.27 5.3,29.66 10.37,29.66 12,28.03 12,26.31
~CS2~: length 37.1
  Top Layer w0.152: 24.2,19.11 25.11,19.11 25.67,18.55 v1(25.67,14.91) ; 34.13,15.12 34.13,9.57 34.77,8.93 45.28,8.93 46.49,7.73 CART2.30 ; v1(34.22,15.23) 34.11,15.12
  Bottom Layer w0.152: v1(34.22,15.23) 33.62,14.62 25.96,14.62 v1(25.67,14.91)
~CS~: length 42.7
  Top Layer w0.152: 38.44,10.71 38.44,11.69 v1(38.47,11.73) ; 8.79,12.62 9.75,12.62 10.03,12.34 10.03,9.79 v2(9.95,9.72) 9,8.77 CART2.5
  Bottom Layer w0.152: v1(38.47,11.73) 37.61,11.73 35.07,9.19 34.35,9.19 33.49,10.05 27.48,10.05 25.8,8.37 11.3,8.37 v2(9.95,9.72)
~RD~: length 47.7
  Top Layer w0.152: 39.43,10.54 39.43,12.18 v1(39.43,12.18) ; 7.5,3.1 7.47,3.12 7.47,12.87 7.7,13.1 8.77,13.1 ; U5.49 11.01,13.1 ; v1(36.43,11.79) 35.91,12.3 35.4,12.3 35.13,12.03 35.13,10.93
  Bottom Layer w0.152: v1(11.02,13.1) 11.91,13.1 13.06,11.95 23.52,11.95 24.72,10.76 35.4,10.76 v1(36.43,11.79) 36.9,11.79 37.3,12.18 v1(39.43,12.18)
~WR~: length 65.8
  Top Layer w0.152: 44.43,30.34 44.43,25.41 46.01,23.83 v1(46.3,23.83) ; v1(12.81,18.3) 11.96,17.45 11.96,14.72 10.84,13.6 7.45,13.6 6.96,13.12 6.96,8.9 6.12,8.06 6.12,3.22 6,3.1 ; v1(33.74,21.37) 33.13,22.04 33.13,23.71 33.11,23.73
  Bottom Layer w0.152: v1(46.3,23.83) 44,21.53 33.9,21.53 v1(33.74,21.37) 32.65,20.28 31.89,20.28 30.91,19.3 13.8,19.3 v1(12.81,18.3)
$1N88719: length 5.2
  Top Layer w0.508: Q2.3 3.49,17.16 MOT1.1 4.66,15.33 D1.2
$1N89891: length 2.8
  Top Layer w0.508: Q2.1 3.7,19.33 4.57,18.46 5.59,18.46
$1N92412: length 3.5
  Top Layer w0.508: 14.89,30.28 18.35,30.28 LED2.2

## Copper pours and planes (outline as drawn; the poured copper is in the pictures)
GND on Top Layer: -4.15,34.18 57.93,34.18 57.93,-4.68 -4.15,-4.68
GND on Bottom Layer: -3.2,33.91 58.32,33.91 58.32,-5.11 -3.2,-5.11

Small or netless copper shapes (teardrops, artwork), in the pictures only: 401 on Top Layer, 163 on Bottom Layer

## Text on the board
Top Silkscreen Layer: Rev1.2 | Designed by Bread | Layout by Mori | TDO | TDI | TMS | TCK | GND | VCC | ChisFlash                F32S128V02
